# Altium schematic sheet LEDs PUSH BUTTONS.SchDoc
size A3; ApprovedBy: SI; CheckedBy: SI; Author: SI; CompanyName: KundenName; DrawnBy: SI; Engineer: SI; Organization: Sven Ingelfinger IT-Trainer; Address1: Ruländerstraße 5; Address2: 74235; Address3: Erlenbach; SheetNumber: 1; SheetTotal: 3; OrganizationDescription: Altium Trainer & Consultant
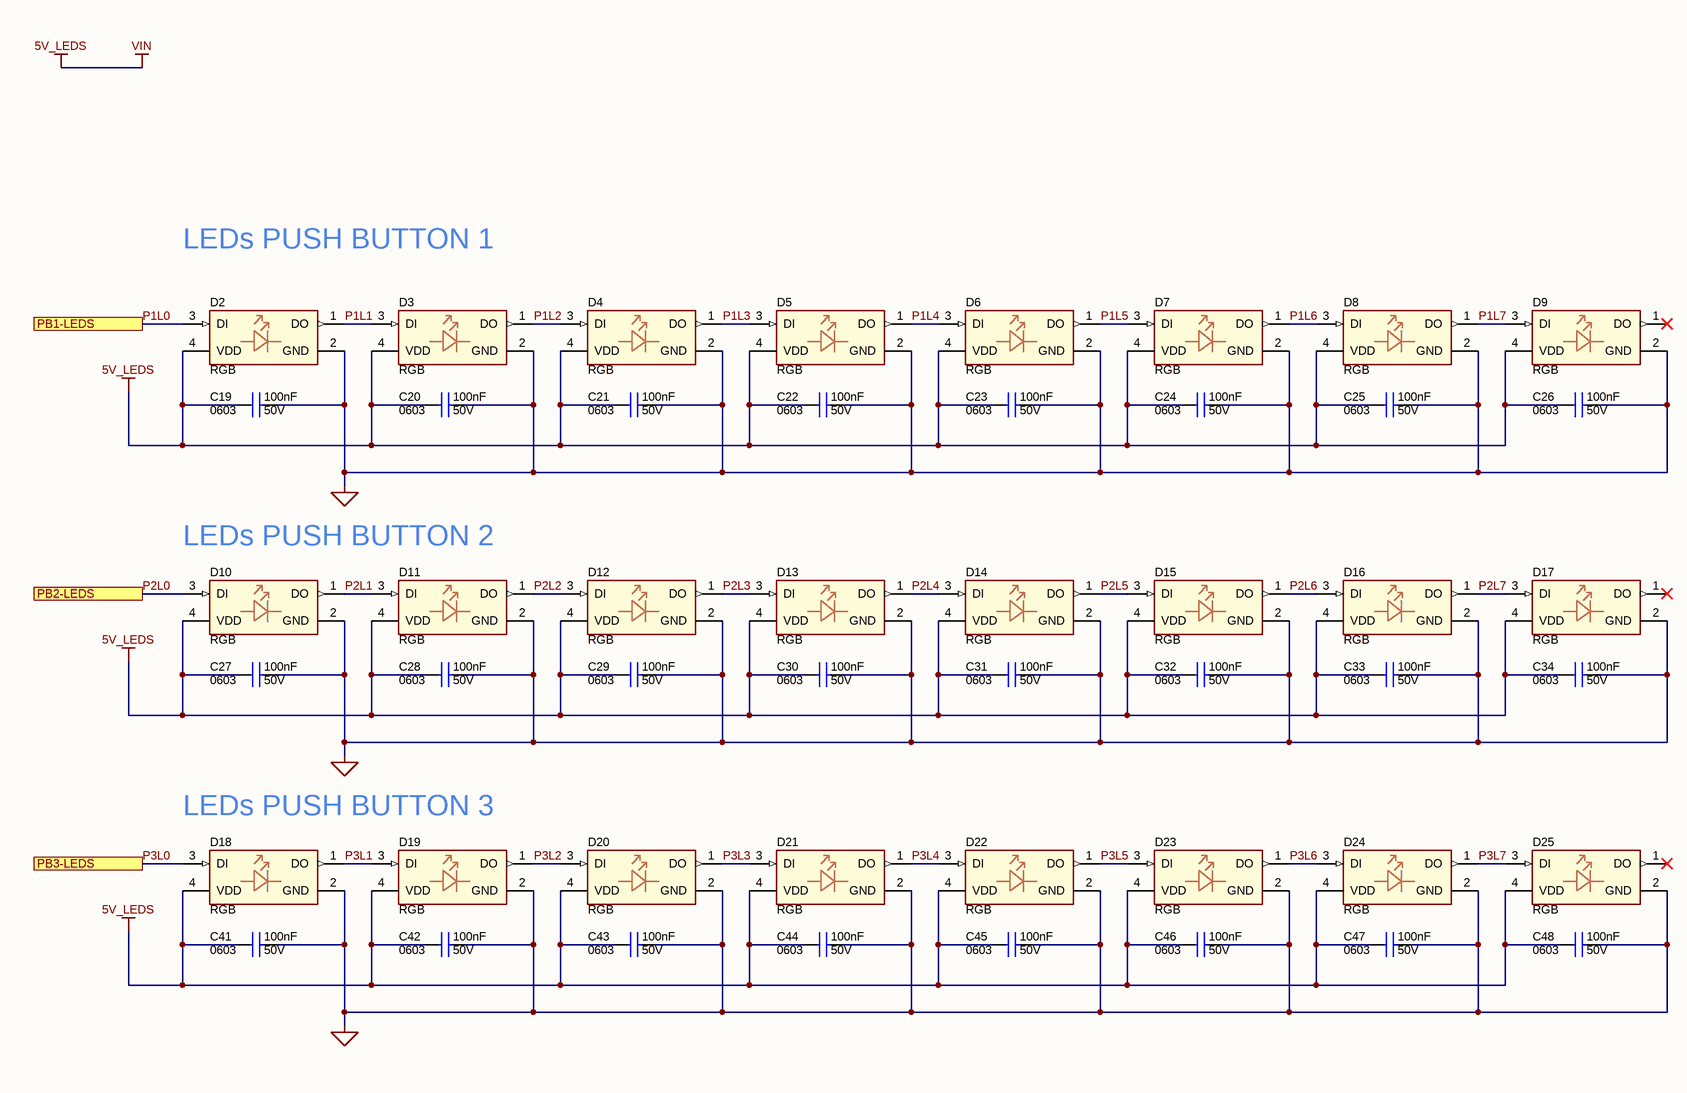
[diagram p0: LEDs PUSH BUTTONS.SchDoc]

## Parts
C19  value 100nF  Voltage: 50V  Case/Package: 0603  [CAPC0603X37L]  (hidden comment: C0603C104K5RACTU)
C20  value 100nF  Voltage: 50V  Case/Package: 0603  [CAPC0603X37L]  (hidden comment: C0603C104K5RACTU)
C21  value 100nF  Voltage: 50V  Case/Package: 0603  [CAPC0603X37L]  (hidden comment: C0603C104K5RACTU)
C22  value 100nF  Voltage: 50V  Case/Package: 0603  [CAPC0603X37L]  (hidden comment: C0603C104K5RACTU)
C23  value 100nF  Voltage: 50V  Case/Package: 0603  [CAPC0603X37L]  (hidden comment: C0603C104K5RACTU)
C24  value 100nF  Voltage: 50V  Case/Package: 0603  [CAPC0603X37L]  (hidden comment: C0603C104K5RACTU)
C25  value 100nF  Voltage: 50V  Case/Package: 0603  [CAPC0603X37L]  (hidden comment: C0603C104K5RACTU)
C26  value 100nF  Voltage: 50V  Case/Package: 0603  [CAPC0603X37L]  (hidden comment: C0603C104K5RACTU)
C27  value 100nF  Voltage: 50V  Case/Package: 0603  [CAPC0603X37L]  (hidden comment: C0603C104K5RACTU)
C28  value 100nF  Voltage: 50V  Case/Package: 0603  [CAPC0603X37L]  (hidden comment: C0603C104K5RACTU)
C29  value 100nF  Voltage: 50V  Case/Package: 0603  [CAPC0603X37L]  (hidden comment: C0603C104K5RACTU)
C30  value 100nF  Voltage: 50V  Case/Package: 0603  [CAPC0603X37L]  (hidden comment: C0603C104K5RACTU)
C31  value 100nF  Voltage: 50V  Case/Package: 0603  [CAPC0603X37L]  (hidden comment: C0603C104K5RACTU)
C32  value 100nF  Voltage: 50V  Case/Package: 0603  [CAPC0603X37L]  (hidden comment: C0603C104K5RACTU)
C33  value 100nF  Voltage: 50V  Case/Package: 0603  [CAPC0603X37L]  (hidden comment: C0603C104K5RACTU)
C34  value 100nF  Voltage: 50V  Case/Package: 0603  [CAPC0603X37L]  (hidden comment: C0603C104K5RACTU)
C41  value 100nF  Voltage: 50V  Case/Package: 0603  [CAPC0603X37L]  (hidden comment: C0603C104K5RACTU)
C42  value 100nF  Voltage: 50V  Case/Package: 0603  [CAPC0603X37L]  (hidden comment: C0603C104K5RACTU)
C43  value 100nF  Voltage: 50V  Case/Package: 0603  [CAPC0603X37L]  (hidden comment: C0603C104K5RACTU)
C44  value 100nF  Voltage: 50V  Case/Package: 0603  [CAPC0603X37L]  (hidden comment: C0603C104K5RACTU)
C45  value 100nF  Voltage: 50V  Case/Package: 0603  [CAPC0603X37L]  (hidden comment: C0603C104K5RACTU)
C46  value 100nF  Voltage: 50V  Case/Package: 0603  [CAPC0603X37L]  (hidden comment: C0603C104K5RACTU)
C47  value 100nF  Voltage: 50V  Case/Package: 0603  [CAPC0603X37L]  (hidden comment: C0603C104K5RACTU)
C48  value 100nF  Voltage: 50V  Case/Package: 0603  [CAPC0603X37L]  (hidden comment: C0603C104K5RACTU)
D2  Color: RGB  [WS2812B-2020]  (hidden comment: WS2812B-2020)
D3  Color: RGB  [WS2812B-2020]  (hidden comment: WS2812B-2020)
D4  Color: RGB  [WS2812B-2020]  (hidden comment: WS2812B-2020)
D5  Color: RGB  [WS2812B-2020]  (hidden comment: WS2812B-2020)
D6  Color: RGB  [WS2812B-2020]  (hidden comment: WS2812B-2020)
D7  Color: RGB  [WS2812B-2020]  (hidden comment: WS2812B-2020)
D8  Color: RGB  [WS2812B-2020]  (hidden comment: WS2812B-2020)
D9  Color: RGB  [WS2812B-2020]  (hidden comment: WS2812B-2020)
D10  Color: RGB  [WS2812B-2020]  (hidden comment: WS2812B-2020)
D11  Color: RGB  [WS2812B-2020]  (hidden comment: WS2812B-2020)
D12  Color: RGB  [WS2812B-2020]  (hidden comment: WS2812B-2020)
D13  Color: RGB  [WS2812B-2020]  (hidden comment: WS2812B-2020)
D14  Color: RGB  [WS2812B-2020]  (hidden comment: WS2812B-2020)
D15  Color: RGB  [WS2812B-2020]  (hidden comment: WS2812B-2020)
D16  Color: RGB  [WS2812B-2020]  (hidden comment: WS2812B-2020)
D17  Color: RGB  [WS2812B-2020]  (hidden comment: WS2812B-2020)
D18  Color: RGB  [WS2812B-2020]  (hidden comment: WS2812B-2020)
D19  Color: RGB  [WS2812B-2020]  (hidden comment: WS2812B-2020)
D20  Color: RGB  [WS2812B-2020]  (hidden comment: WS2812B-2020)
D21  Color: RGB  [WS2812B-2020]  (hidden comment: WS2812B-2020)
D22  Color: RGB  [WS2812B-2020]  (hidden comment: WS2812B-2020)
D23  Color: RGB  [WS2812B-2020]  (hidden comment: WS2812B-2020)
D24  Color: RGB  [WS2812B-2020]  (hidden comment: WS2812B-2020)
D25  Color: RGB  [WS2812B-2020]  (hidden comment: WS2812B-2020)

## Ports
PB1-LEDS, PB2-LEDS, PB3-LEDS

## Nets
5V_LEDS: C19.1 C20.1 C21.1 C22.1 C23.1 C24.1 C25.1 C26.1 C27.1 C28.1 C29.1 C30.1 C31.1 C32.1 C33.1 C34.1 C41.1 C42.1 C43.1 C44.1 C45.1 C46.1 C47.1 C48.1 D2.4(VDD) D3.4(VDD) D4.4(VDD) D5.4(VDD) D6.4(VDD) D7.4(VDD) D8.4(VDD) D9.4(VDD) D10.4(VDD) D11.4(VDD) D12.4(VDD) D13.4(VDD) D14.4(VDD) D15.4(VDD) D16.4(VDD) D17.4(VDD) D18.4(VDD) D19.4(VDD) D20.4(VDD) D21.4(VDD) D22.4(VDD) D23.4(VDD) D24.4(VDD) D25.4(VDD)  [also labelled VIN]
GND: C19.2 C20.2 C21.2 C22.2 C23.2 C24.2 C25.2 C26.2 C27.2 C28.2 C29.2 C30.2 C31.2 C32.2 C33.2 C34.2 C41.2 C42.2 C43.2 C44.2 C45.2 C46.2 C47.2 C48.2 D2.2(GND) D3.2(GND) D4.2(GND) D5.2(GND) D6.2(GND) D7.2(GND) D8.2(GND) D9.2(GND) D10.2(GND) D11.2(GND) D12.2(GND) D13.2(GND) D14.2(GND) D15.2(GND) D16.2(GND) D17.2(GND) D18.2(GND) D19.2(GND) D20.2(GND) D21.2(GND) D22.2(GND) D23.2(GND) D24.2(GND) D25.2(GND)
P1L0: D2.3(DI) ; port PB1-LEDS
P1L1: D2.1(DO) D3.3(DI)
P1L2: D3.1(DO) D4.3(DI)
P1L3: D4.1(DO) D5.3(DI)
P1L4: D5.1(DO) D6.3(DI)
P1L5: D6.1(DO) D7.3(DI)
P1L6: D7.1(DO) D8.3(DI)
P1L7: D8.1(DO) D9.3(DI)
P2L0: D10.3(DI) ; port PB2-LEDS
P2L1: D10.1(DO) D11.3(DI)
P2L2: D11.1(DO) D12.3(DI)
P2L3: D12.1(DO) D13.3(DI)
P2L4: D13.1(DO) D14.3(DI)
P2L5: D14.1(DO) D15.3(DI)
P2L6: D15.1(DO) D16.3(DI)
P2L7: D16.1(DO) D17.3(DI)
P3L0: D18.3(DI) ; port PB3-LEDS
P3L1: D18.1(DO) D19.3(DI)
P3L2: D19.1(DO) D20.3(DI)
P3L3: D20.1(DO) D21.3(DI)
P3L4: D21.1(DO) D22.3(DI)
P3L5: D22.1(DO) D23.3(DI)
P3L6: D23.1(DO) D24.3(DI)
P3L7: D24.1(DO) D25.3(DI)

Not connected (* = marked no-connect by the designer): D9 1(DO)*; D17 1(DO)*; D25 1(DO)*

## Notes on the sheet
- LEDs PUSH BUTTON 1
- LEDs PUSH BUTTON 2
- LEDs PUSH BUTTON 3
- Project
- Schematic Sheet
- EDATRON Solutions GmbH
- Engineering | Training | Consulting
- www.edatron-solutions.com <http://www.edatron-solutions.com>
- Assembly Variant
- Drawn
- Date
- Checked
- Approved
- Project Number
- Customer
- Version/ Revisionindex
- Sheet
- /
- Contact Person
- Name:
- E-Mail:
- Phone:

## Library data of the parts
C19-C34 C41-C48 = CMP-00094-12: CAPACITOR 100 nF 0603 X7R 50V 10%; Manufacturer 1: Kemet; Comment Designer: can be substituted same values other manufacturer; Operating Temperature (max): 125°C; Manufacturer 1 Part Number: C0603C104K5RACTU; Dielectric: X7R; Operating Temperature (min): -55°C; Tolerance: 10%
D2-D25 = CMP-00193-01: LED; Manufacturer 1: Worldsemi; Voltage: 5V; Value: WS2812B-2020; Operating Temperature (min): -25°C; Manufacturer 1 Part Number: WS2812B-2020; Operating Temperature (max): 85°C; Case/Package: 2020